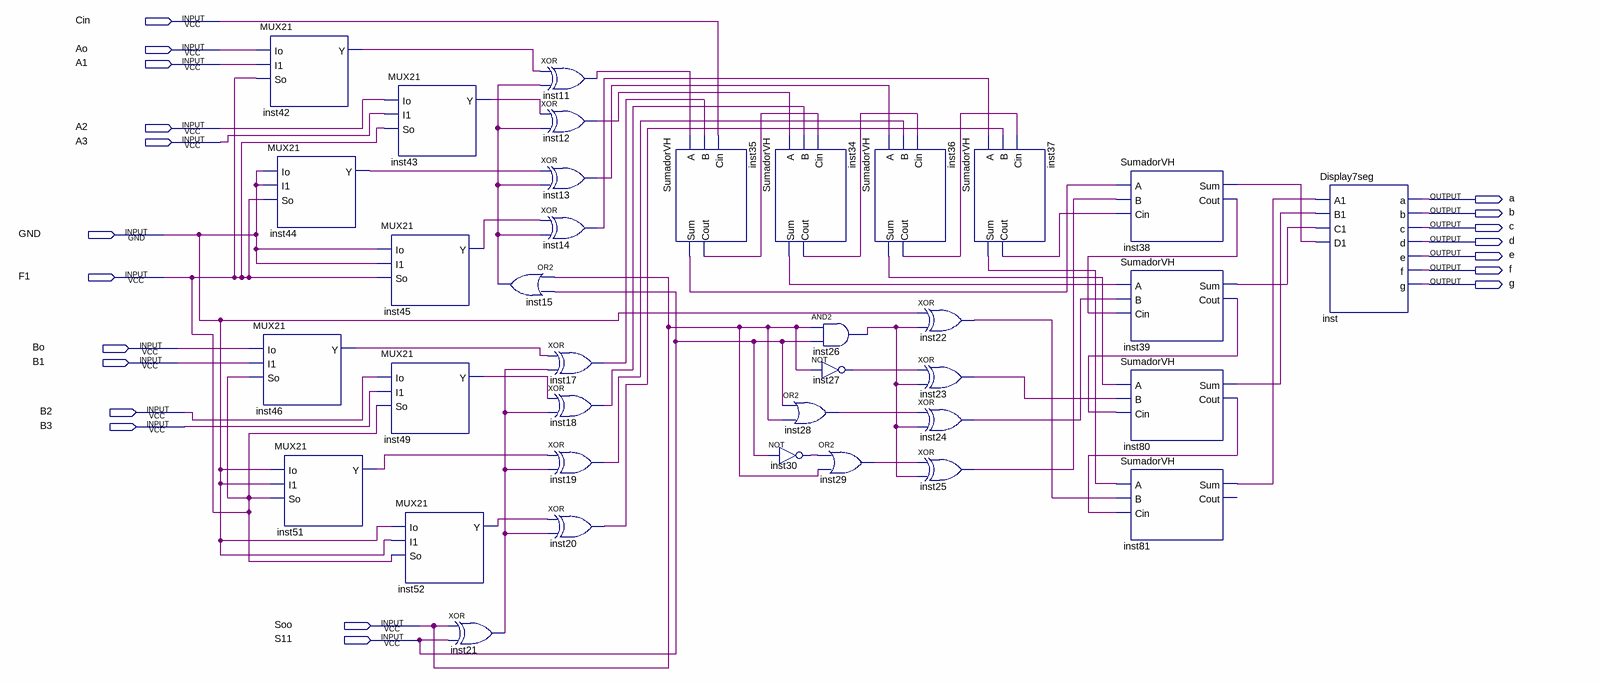
[diagram p0: schematic sheet]
// Quartus schematic ALUdefinitiva.bdf as structural Verilog: 36 symbols, 20 pins
module ALUdefinitiva (
  input  Cin,
  input  Ao,
  input  A1,
  input  A2,
  input  A3,
  input  GND,
  input  F1,
  input  Bo,
  input  B1,
  input  B2,
  input  B3,
  input  Soo,
  input  S11,
  output a,
  output b,
  output c,
  output d,
  output e,
  output f,
  output g
);

  wire inst11_out, inst12_out, inst13_out, inst14_out, inst15_out, inst17_out, inst18_out, inst19_out,
       inst20_out, inst21_out, inst22_out, inst23_out, inst24_out, inst25_out, inst26_out, inst27_out,
       inst28_out, inst29_out, inst30_out, inst34_cout, inst34_sum, inst35_cout, inst35_sum, inst36_cout,
       inst36_sum, inst37_cout, inst37_sum, inst38_cout, inst38_sum, inst39_cout, inst39_sum, inst42_y,
       inst43_y, inst44_y, inst45_y, inst46_y, inst49_y, inst51_y, inst52_y, inst80_cout, inst80_sum,
       inst81_sum;

  MUX21 inst42 (.Io(Ao), .I1(A1), .So(F1), .Y(inst42_y));
  MUX21 inst44 (.Io(GND), .I1(GND), .So(F1), .Y(inst44_y));
  MUX21 inst46 (.Io(Bo), .I1(B1), .So(F1), .Y(inst46_y));
  MUX21 inst51 (.Io(GND), .I1(GND), .So(F1), .Y(inst51_y));
  MUX21 inst43 (.Io(A2), .I1(A3), .So(F1), .Y(inst43_y));
  MUX21 inst45 (.Io(GND), .I1(GND), .So(F1), .Y(inst45_y));
  MUX21 inst49 (.Io(B2), .I1(B3), .So(F1), .Y(inst49_y));
  MUX21 inst52 (.Io(GND), .I1(GND), .So(F1), .Y(inst52_y));
  xor inst21 (inst21_out, Soo, S11);
  or inst15 (inst15_out, Soo, S11);
  xor inst11 (inst11_out, inst42_y, inst15_out);
  xor inst12 (inst12_out, inst43_y, inst15_out);
  xor inst13 (inst13_out, inst44_y, inst15_out);
  xor inst14 (inst14_out, inst45_y, inst15_out);
  xor inst17 (inst17_out, inst46_y, inst21_out);
  xor inst18 (inst18_out, inst49_y, inst21_out);
  xor inst19 (inst19_out, inst51_y, inst21_out);
  xor inst20 (inst20_out, inst52_y, inst21_out);
  SumadorVH inst35 (.A(inst11_out), .B(inst17_out), .Cin(Cin), .Sum(inst35_sum), .Cout(inst35_cout));
  SumadorVH inst34 (.A(inst12_out), .B(inst18_out), .Cin(inst35_cout), .Sum(inst34_sum), .Cout(inst34_cout));
  or inst28 (inst28_out, S11, Soo);
  not inst30 (inst30_out, S11);
  SumadorVH inst36 (.A(inst13_out), .B(inst19_out), .Cin(inst34_cout), .Sum(inst36_sum), .Cout(inst36_cout));
  and inst26 (inst26_out, Soo, S11);
  not inst27 (inst27_out, Soo);
  or inst29 (inst29_out, inst30_out, Soo);
  xor inst22 (inst22_out, GND, inst26_out);
  xor inst23 (inst23_out, inst27_out, inst26_out);
  xor inst24 (inst24_out, inst28_out, inst26_out);
  xor inst25 (inst25_out, inst29_out, inst26_out);
  SumadorVH inst37 (.A(inst14_out), .B(inst20_out), .Cin(inst36_cout), .Sum(inst37_sum), .Cout(inst37_cout));
  SumadorVH inst38 (.A(inst35_sum), .B(inst25_out), .Cin(inst37_cout), .Sum(inst38_sum), .Cout(inst38_cout));
  SumadorVH inst39 (.A(inst34_sum), .B(inst24_out), .Cin(inst38_cout), .Sum(inst39_sum), .Cout(inst39_cout));
  SumadorVH inst80 (.A(inst36_sum), .B(inst23_out), .Cin(inst39_cout), .Sum(inst80_sum), .Cout(inst80_cout));
  SumadorVH inst81 (.A(inst37_sum), .B(inst22_out), .Cin(inst80_cout), .Sum(inst81_sum));  // open: Cout
  Display7seg inst (
    .A1(inst81_sum), .B1(inst80_sum), .C1(inst39_sum), .D1(inst38_sum), .a(a), .b(b), .c(c), .d(d), .e(e),
    .f(f), .g(g));
endmodule
